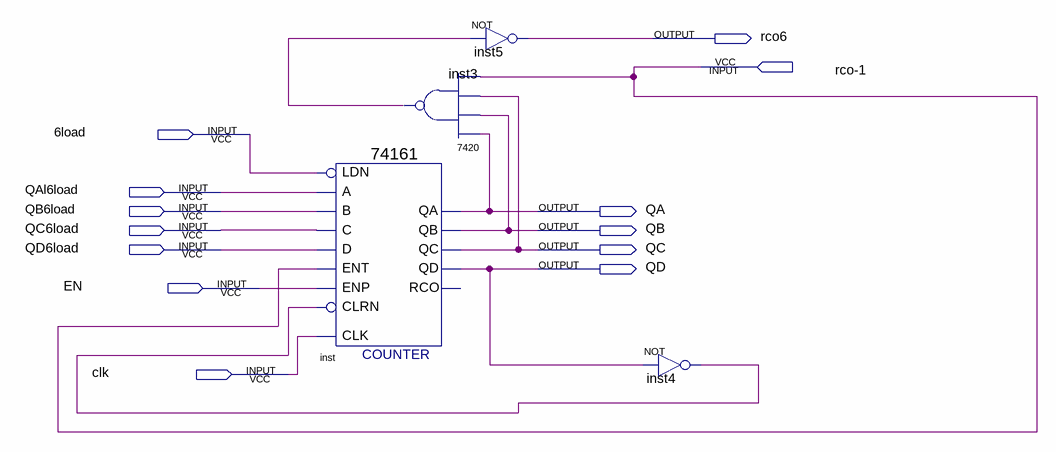
[diagram p0: schematic sheet]
// Quartus schematic mod6.bdf as structural Verilog: 4 symbols, 13 pins
module mod6 (
  input  \rco-1 ,
  input  \6load ,
  input  QAl6load,
  input  QB6load,
  input  QC6load,
  input  QD6load,
  input  EN,
  input  clk,
  output rco6,
  output QA,
  output QB,
  output QC,
  output QD
);

  wire inst3_1, inst4_out;

  \74161  inst (
    .CLRN(inst4_out), .CLK(clk), .ENP(EN), .LDN(\6load ), .A(QAl6load), .D(QD6load), .ENT(\rco-1 ),
    .B(QB6load), .C(QC6load), .QD(QD), .QC(QC), .QB(QB), .QA(QA));  // open: RCO
  \7420  inst3 (.\4 (QC), .\2 (QA), .\3 (QB), .\5 (\rco-1 ), .\1 (inst3_1));
  not inst5 (rco6, inst3_1);
  not inst4 (inst4_out, QD);
endmodule
